# Altium schematic sheet SAMA7G54_DDR3L.SchDoc
size 420 x 297 mm; SheetNumber: 12; SheetTotal: 32
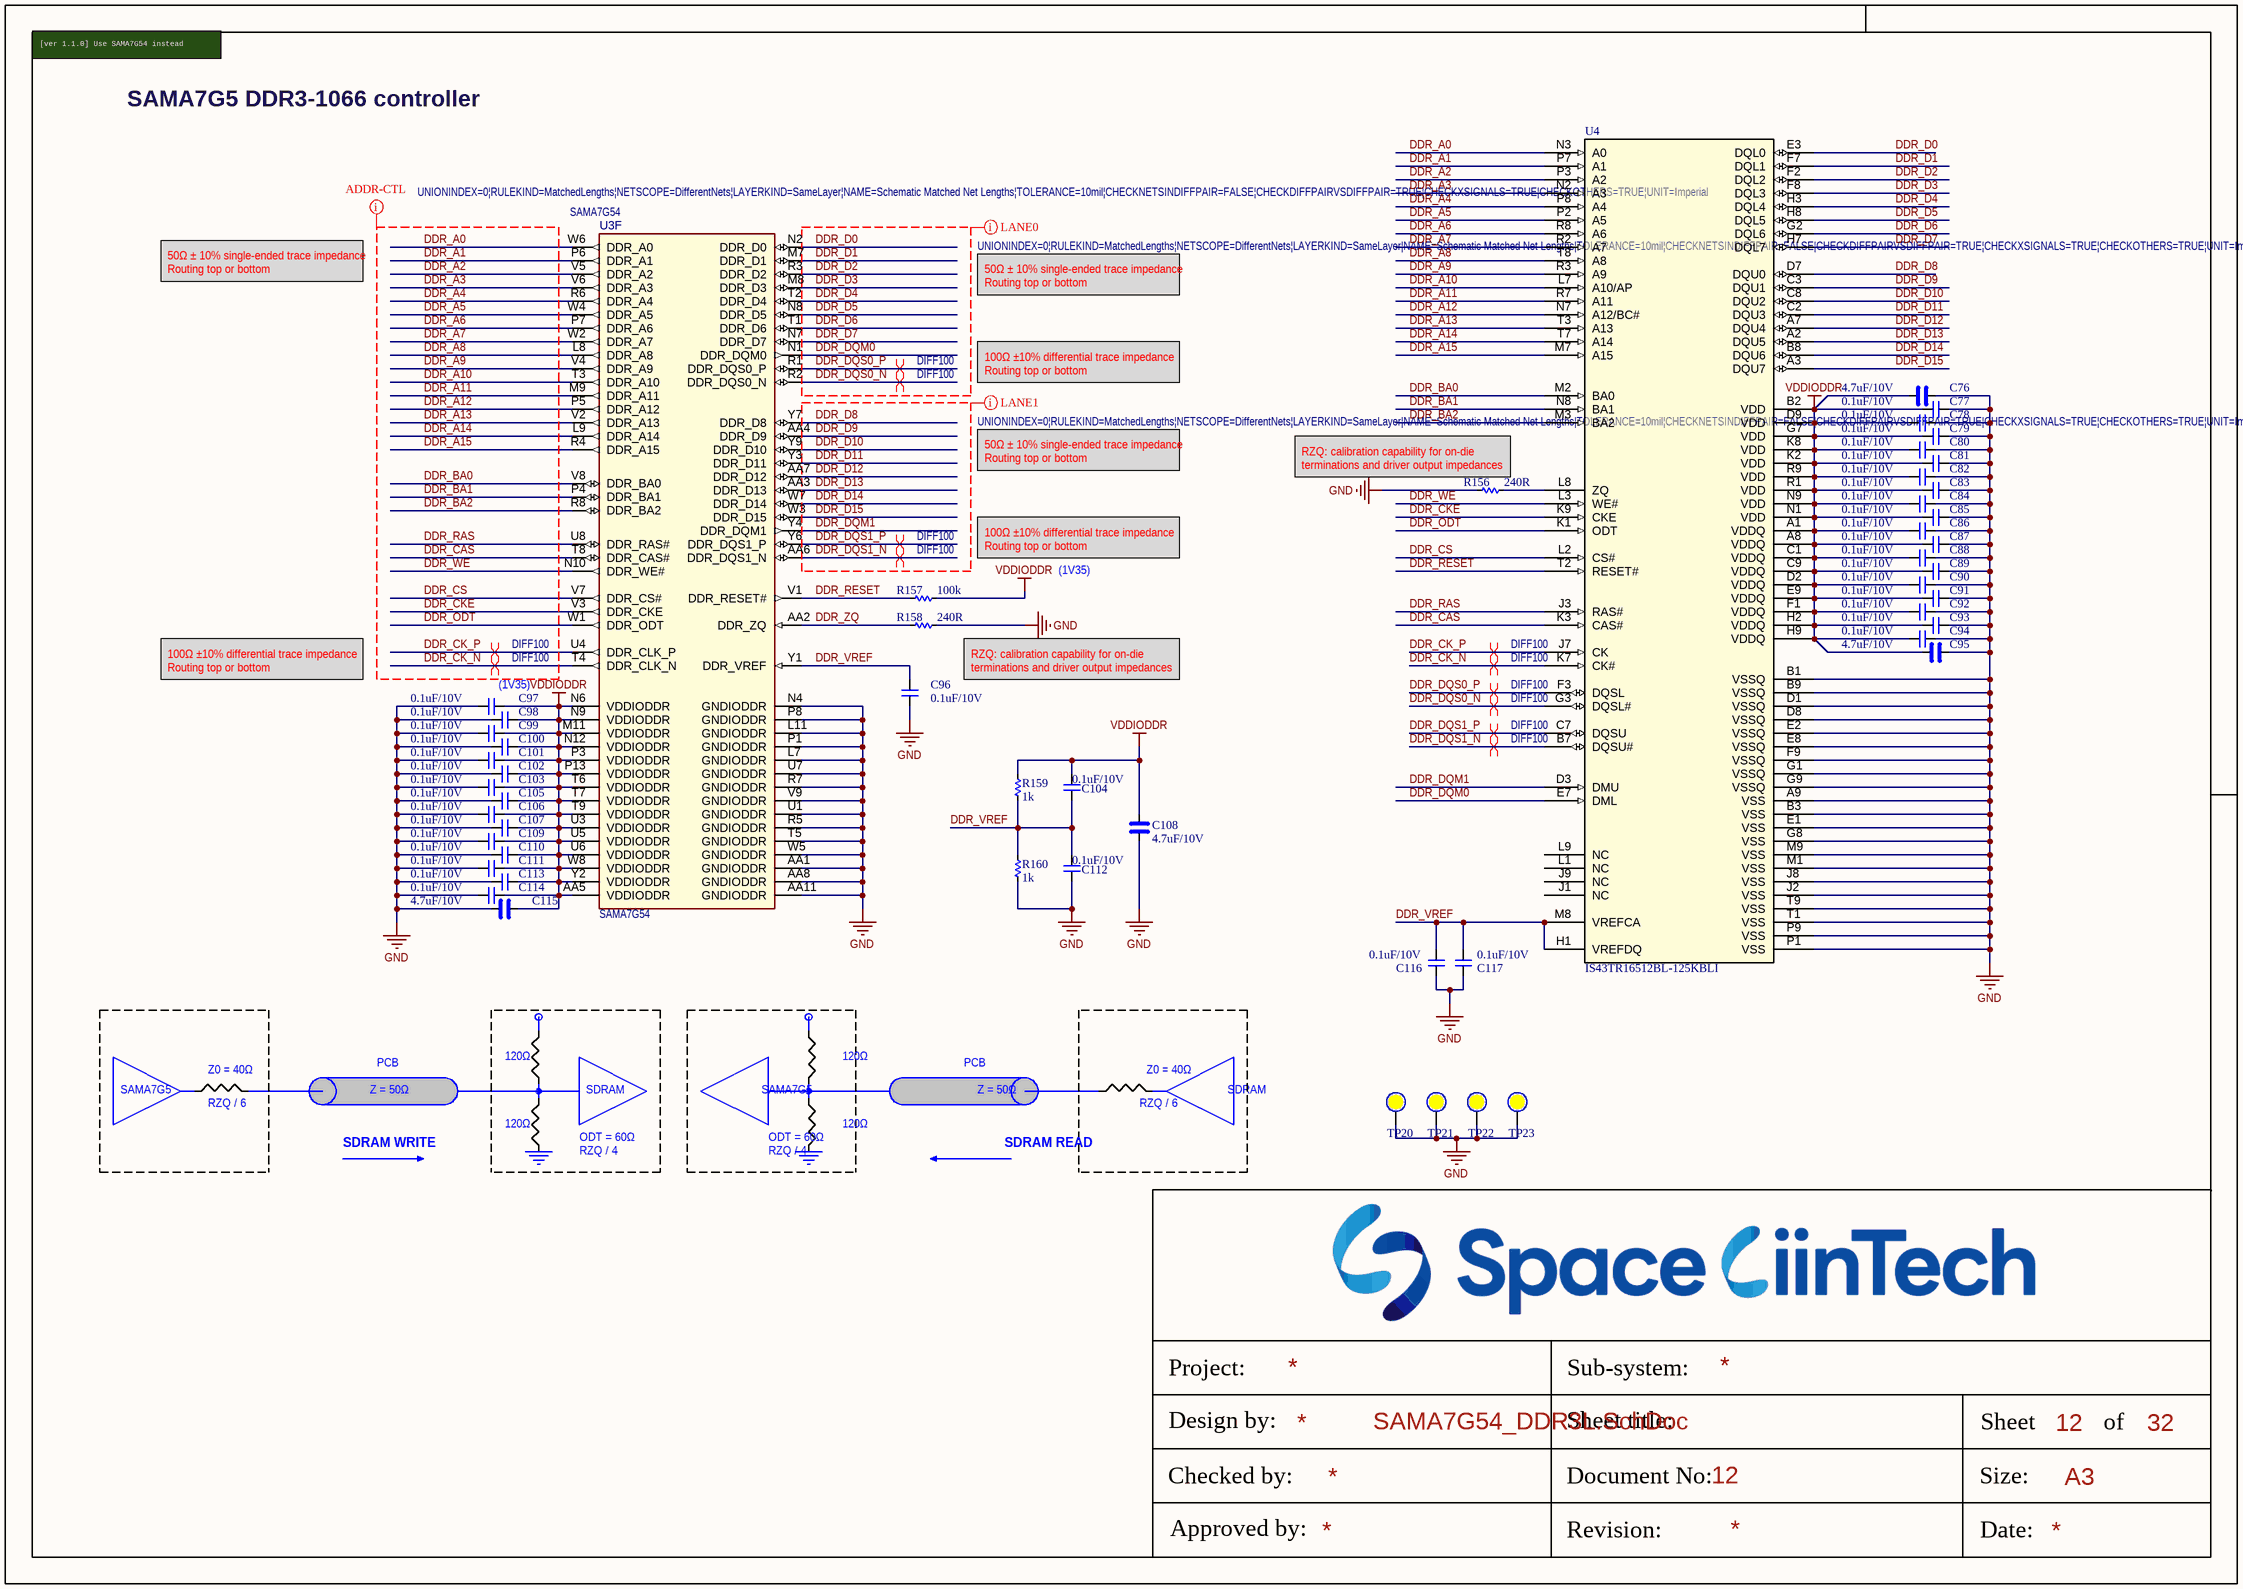
[diagram p0: SAMA7G54_DDR3L.SchDoc]

## Parts
C76  4.7uF/10V  [CAP_C_1005X50_L]
C77  0.1uF/10V  [CAP_C_0603x30]
C78  0.1uF/10V  [CAP_C_0603x30]
C79  0.1uF/10V  [CAP_C_0603x30]
C80  0.1uF/10V  [CAP_C_0603x30]
C81  0.1uF/10V  [CAP_C_0603x30]
C82  0.1uF/10V  [CAP_C_0603x30]
C83  0.1uF/10V  [CAP_C_0603x30]
C84  0.1uF/10V  [CAP_C_0603x30]
C85  0.1uF/10V  [CAP_C_0603x30]
C86  0.1uF/10V  [CAP_C_0603x30]
C87  0.1uF/10V  [CAP_C_0603x30]
C88  0.1uF/10V  [CAP_C_0603x30]
C89  0.1uF/10V  [CAP_C_0603x30]
C90  0.1uF/10V  [CAP_C_0603x30]
C91  0.1uF/10V  [CAP_C_0603x30]
C92  0.1uF/10V  [CAP_C_0603x30]
C93  0.1uF/10V  [CAP_C_0603x30]
C94  0.1uF/10V  [CAP_C_0603x30]
C95  4.7uF/10V  [CAP_C_1005X50_L]
C96  0.1uF/10V  [CAP_C_0603x30]
C97  0.1uF/10V  [CAP_C_0603x30]
C98  0.1uF/10V  [CAP_C_0603x30]
C99  0.1uF/10V  [CAP_C_0603x30]
C100  0.1uF/10V  [CAP_C_0603x30]
C101  0.1uF/10V  [CAP_C_0603x30]
C102  0.1uF/10V  [CAP_C_0603x30]
C103  0.1uF/10V  [CAP_C_0603x30]
C104  0.1uF/10V  [CAP_C_0603x30]
C105  0.1uF/10V  [CAP_C_0603x30]
C106  0.1uF/10V  [CAP_C_0603x30]
C107  0.1uF/10V  [CAP_C_0603x30]
C108  4.7uF/10V  [CAP_C_1005X50_L]
C109  0.1uF/10V  [CAP_C_0603x30]
C110  0.1uF/10V  [CAP_C_0603x30]
C111  0.1uF/10V  [CAP_C_0603x30]
C112  0.1uF/10V  [CAP_C_0603x30]
C113  0.1uF/10V  [CAP_C_0603x30]
C114  0.1uF/10V  [CAP_C_0603x30]
C115  4.7uF/10V  [CAP_C_1005X50_L]
C116  0.1uF/10V  [CAP_C_0603x30]
C117  0.1uF/10V  [CAP_C_0603x30]
R156  240R  [RES_C_0603X30]
R157  100k  [RES_C_0603X30]
R158  240R  [RES_C_0603X30]
R159  1k  [RES_C_0603X30]
R160  1k  [RES_C_0603X30]
TP20  (no value)  [Testpoint_80_pin0]  (no BOM)
TP21  (no value)  [Testpoint_80_pin0]  (no BOM)
TP22  (no value)  [Testpoint_80_pin0]  (no BOM)
TP23  (no value)  [Testpoint_80_pin0]  (no BOM)
U3  SAMA7G54  [TFBGA-343_14x14 - 2.5mm]  (part F of 8)
U4  IS43TR16512BL-125KBLI  [TWBGA96_ISI]

## Nets
GND: C76.1 C77.1 C78.1 C79.1 C80.1 C81.1 C82.1 C83.1 C84.1 C85.1 C86.1 C87.1 C88.1 C89.1 C90.1 C91.1 C92.1 C93.1 C94.1 C95.1 C96.2 C97.2 C98.2 C99.2 C100.2 C101.2 C102.2 C103.2 C105.2 C106.2 C107.2 C108.2 C109.2 C110.2 C111.2 C112.2 C113.2 C114.2 C115.2 C116.2 C117.2 R156.2 R158.1 R160.2 TP20.0 TP21.0 TP22.0 TP23.0 U3.AA1(GNDIODDR) U3.AA8(GNDIODDR) U3.AA11(GNDIODDR) U3.L7(GNDIODDR) U3.L11(GNDIODDR) U3.N4(GNDIODDR) U3.P1(GNDIODDR) U3.P8(GNDIODDR) U3.R5(GNDIODDR) U3.R7(GNDIODDR) U3.T5(GNDIODDR) U3.U1(GNDIODDR) U3.U7(GNDIODDR) U3.V9(GNDIODDR) U3.W5(GNDIODDR) U4.A9(VSS) U4.B1(VSSQ) U4.B3(VSS) U4.B9(VSSQ) U4.D1(VSSQ) U4.D8(VSSQ) U4.E1(VSS) U4.E2(VSSQ) U4.E8(VSSQ) U4.F9(VSSQ) U4.G1(VSSQ) U4.G8(VSS) U4.G9(VSSQ) U4.J2(VSS) U4.J8(VSS) U4.M1(VSS) U4.M9(VSS) U4.P1(VSS) U4.P9(VSS) U4.T1(VSS) U4.T9(VSS)
VDDIODDR: C76.2 C77.2 C78.2 C79.2 C80.2 C81.2 C82.2 C83.2 C84.2 C85.2 C86.2 C87.2 C88.2 C89.2 C90.2 C91.2 C92.2 C93.2 C94.2 C95.2 C97.1 C98.1 C99.1 C100.1 C101.1 C102.1 C103.1 C104.1 C105.1 C106.1 C107.1 C108.1 C109.1 C110.1 C111.1 C113.1 C114.1 C115.1 R157.1 R159.1 U3.AA5(VDDIODDR) U3.M11(VDDIODDR) U3.N6(VDDIODDR) U3.N9(VDDIODDR) U3.N12(VDDIODDR) U3.P3(VDDIODDR) U3.P13(VDDIODDR) U3.T6(VDDIODDR) U3.T7(VDDIODDR) U3.T9(VDDIODDR) U3.U3(VDDIODDR) U3.U5(VDDIODDR) U3.U6(VDDIODDR) U3.W8(VDDIODDR) U3.Y2(VDDIODDR) U4.A1(VDDQ) U4.A8(VDDQ) U4.B2(VDD) U4.C1(VDDQ) U4.C9(VDDQ) U4.D2(VDDQ) U4.D9(VDD) U4.E9(VDDQ) U4.F1(VDDQ) U4.G7(VDD) U4.H2(VDDQ) U4.H9(VDDQ) U4.K2(VDD) U4.K8(VDD) U4.N1(VDD) U4.N9(VDD) U4.R1(VDD) U4.R9(VDD)
DDR_A0: U3.W6(DDR_A0) U4.N3(A0)
DDR_A1: U3.P6(DDR_A1) U4.P7(A1)
DDR_A2: U3.V5(DDR_A2) U4.P3(A2)
DDR_A3: U3.V6(DDR_A3) U4.N2(A3)
DDR_A4: U3.R6(DDR_A4) U4.P8(A4)
DDR_A5: U3.W4(DDR_A5) U4.P2(A5)
DDR_A6: U3.P7(DDR_A6) U4.R8(A6)
DDR_A7: U3.W2(DDR_A7) U4.R2(A7)
DDR_A8: U3.L8(DDR_A8) U4.T8(A8)
DDR_A9: U3.V4(DDR_A9) U4.R3(A9)
DDR_A10: U3.T3(DDR_A10) U4.L7(A10/AP)
DDR_A11: U3.M9(DDR_A11) U4.R7(A11)
DDR_A12: U3.P5(DDR_A12) U4.N7(A12/BC#)
DDR_A13: U3.V2(DDR_A13) U4.T3(A13)
DDR_A14: U3.L9(DDR_A14) U4.T7(A14)
DDR_A15: U3.R4(DDR_A15) U4.M7(A15)
DDR_BA0: U3.V8(DDR_BA0) U4.M2(BA0)
DDR_BA1: U3.P4(DDR_BA1) U4.N8(BA1)
DDR_BA2: U3.R8(DDR_BA2) U4.M3(BA2)
DDR_CAS: U3.T8(DDR_CAS#) U4.K3(CAS#)
DDR_CK_N: U3.T4(DDR_CLK_N) U4.K7(CK#)
DDR_CK_P: U3.U4(DDR_CLK_P) U4.J7(CK)
DDR_CKE: U3.V3(DDR_CKE) U4.K9(CKE)
DDR_CS: U3.V7(DDR_CS#) U4.L2(CS#)
DDR_D0: U3.N2(DDR_D0) U4.E3(DQL0)
DDR_D1: U3.M7(DDR_D1) U4.F7(DQL1)
DDR_D2: U3.R3(DDR_D2) U4.F2(DQL2)
DDR_D3: U3.M8(DDR_D3) U4.F8(DQL3)
DDR_D4: U3.T2(DDR_D4) U4.H3(DQL4)
DDR_D5: U3.N8(DDR_D5) U4.H8(DQL5)
DDR_D6: U3.T1(DDR_D6) U4.G2(DQL6)
DDR_D7: U3.N7(DDR_D7) U4.H7(DQL7)
DDR_D8: U3.Y7(DDR_D8) U4.D7(DQU0)
DDR_D9: U3.AA4(DDR_D9) U4.C3(DQU1)
DDR_D10: U3.Y9(DDR_D10) U4.C8(DQU2)
DDR_D11: U3.Y3(DDR_D11) U4.C2(DQU3)
DDR_D12: U3.AA7(DDR_D12) U4.A7(DQU4)
DDR_D13: U3.AA3(DDR_D13) U4.A2(DQU5)
DDR_D14: U3.W7(DDR_D14) U4.B8(DQU6)
DDR_D15: U3.W3(DDR_D15) U4.A3(DQU7)
DDR_DQM0: U3.N1(DDR_DQM0) U4.E7(DML)
DDR_DQM1: U3.Y4(DDR_DQM1) U4.D3(DMU)
DDR_DQS0_N: U3.R2(DDR_DQS0_N) U4.G3(DQSL#)
DDR_DQS0_P: U3.R1(DDR_DQS0_P) U4.F3(DQSL)
DDR_DQS1_N: U3.AA6(DDR_DQS1_N) U4.B7(DQSU#)
DDR_DQS1_P: U3.Y6(DDR_DQS1_P) U4.C7(DQSU)
DDR_ODT: U3.W1(DDR_ODT) U4.K1(ODT)
DDR_RAS: U3.U8(DDR_RAS#) U4.J3(RAS#)
DDR_RESET: R157.2 U3.V1(DDR_RESET#) U4.T2(RESET#)
DDR_VREF: C96.1 C104.2 C112.1 C116.1 C117.1 R159.2 R160.1 U3.Y1(DDR_VREF) U4.H1(VREFDQ) U4.M8(VREFCA)
DDR_WE: U3.N10(DDR_WE#) U4.L3(WE#)
DDR_ZQ: R158.2 U3.AA2(DDR_ZQ)
NetR156_1: R156.1 U4.L8(ZQ)

Not connected (* = marked no-connect by the designer): U4 J1(NC) J9(NC) L1(NC) L9(NC)

## Layout directives
net class DDR-LANE0; rule Matched Net Lengths [Tolerance = 10mil]: DDR_D0, DDR_D1, DDR_D2, DDR_D3, DDR_D4, DDR_D5, DDR_D6, DDR_D7, DDR_DQM0, DDR_DQS0_N, DDR_DQS0_P
net class DDR-LANE1; rule Matched Net Lengths [Tolerance = 10mil]: DDR_D8, DDR_D9, DDR_D10, DDR_D11, DDR_D12, DDR_D13, DDR_D14, DDR_D15, DDR_DQM1, DDR_DQS1_N, DDR_DQS1_P
net class DDR-ADDR-CTL; rule Matched Net Lengths [Tolerance = 10mil]: DDR_A0, DDR_A1, DDR_A2, DDR_A3, DDR_A4, DDR_A5, DDR_A6, DDR_A7, DDR_A8, DDR_A9, DDR_A10, DDR_A11, DDR_A12, DDR_A13, DDR_A14, DDR_A15, DDR_BA0, DDR_BA1, DDR_BA2, DDR_CAS, DDR_CK_N, DDR_CK_P, DDR_CKE, DDR_CS, DDR_ODT, DDR_RAS, DDR_WE
differential pair; differential pair class DIFF100; net class DIFF100; rule Matched Net Lengths [Tolerance = 4mil]: DDR_CK_N, DDR_CK_P, DDR_DQS0_N, DDR_DQS0_P, DDR_DQS1_N, DDR_DQS1_P

## Notes on the sheet
- [ver 1.1.0] Use SAMA7G54 instead
- SAMA7G5 DDR3-1066 controller
- 50Ω ± 10% single-ended trace impedance
  Routing top or bottom
- 100Ω ±10% differential trace impedance
  Routing top or bottom
- (near R156) RZQ: calibration capability for on-die terminations and driver output impedances
- (1V35)
- (near C97) (1V35)
- RZQ: calibration capability for on-die terminations and driver output impedances
- Z0 = 40Ω
- PCB
- 120Ω
- SAMA7G5
- RZQ / 6
- Z = 50Ω
- SDRAM
- SDRAM WRITE
- ODT = 60Ω
- RZQ / 4
- SDRAM READ
- Project:
- Sub-system:
- Design by:
- Sheet title:
- Sheet
- A3
- of
- Checked by:
- Approved by:
- Revision:
- Document No:
- Size:
- Date:

## Library data of the parts
C76 C95 C108 C115 = _CAP_C_High_2: CAP
C77-C94 C96-C107 C109-C114 C116 C117 = _CAP_C_2: CAP
R156-R160 = _RES_B_2: RES
TP20-TP23 = Test Point: Solder: NF
U3 = SAMA7G54: SAMA7G54 MPU 1000MHz Cortex-A7 TFBGA-343; Manufacturer Part Number 1: SAMA7G54-V/4HB; Manufacturer 1: Microchip; Description_: MCHP MPU 32-BIT Cortex-A7 1000MHz 128kB SAMA7G54-V/4HB TFBGA-343; Populated: YES; MCHP-ID: MIC8923; Symbol: SAMA7G54 TFBGA-343; Dev Tools Status: Design; Owner: Ciprian Abramov; Package: TFBGA-343; Value: SAMA7G54; Type: 32-Bit MPU; Status: MCL Design; Revision: 1; Category: MCHP-Microcontroller; ComponentLink1Description: SVN Datasheet; ComponentLink2Description: Local Datasheet; ComponentLink3URL: C:\ALTIUM_WORK\00001_MCHP-CDB\Library\LibraryRefs\SAMA7G54 TFBGA-343.SchLib; ComponentLink3Description: Open Symbol; ComponentLink4URL: C:\ALTIUM_WORK\00001_MCHP-CDB\Library\Footprints\TFBGA-343_14x14.PcbLib; ComponentLink4Description: Open Footprint; ComponentLink5Description: Open Footprint 2; ComponentLink6Description: Open Footprint 3; ComponentLink7Description: Open Footprint 4; Supplier 1: Microchip; Supplier Part Number 1: SAMA7G54-V/4HB; Quantity Override: 1
U4 = IC_RAM_IS43TR16512BL-125KBLI: DDR3L; Manufacturer_Name: ISSI; Copyright: Copyright (C) 2025 Ultra Librarian. All rights reserved.; Manufacturer_Part_Number: IS43TR16512BL-125KBLI; RefDes: RefDes; Type: Type